# Altium schematic sheet hmi.SchDoc: HMI
size A4 portrait; Author: wq; DrawnBy: wq; Organization: Fulei Electronic; Address1: 14a Yulan Rd; Address2: Hefei; Address3: Anhui Pro.; Address4: CHN; DocumentNumber: 1; Revision: betaV1.0; SheetNumber: 1; SheetTotal: 1
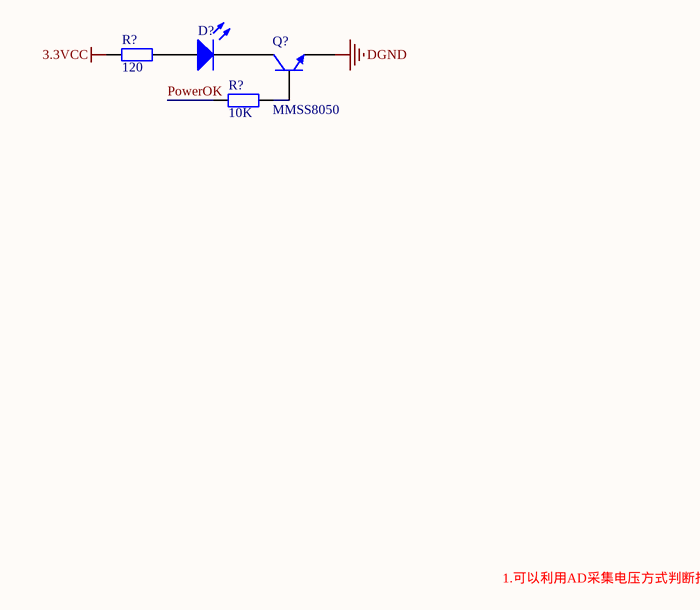
[diagram p0: hmi.SchDoc]

## Parts
(Parts that share a designator on the sheet are numbered #1, #2 ... from top to bottom, then left to right.)
D?  150080GS75000  [LEDΦ3.0]  (value not drawn)
Q?  MMSS8050  [SOT-23-BJT]
R?#1  value 120  [0805R]  (hidden comment: RC0805JR-07120RL)
R?#2  value 10K  [0805R]  (hidden comment: RC0805JR-0710KL)

## Nets
3.3VCC: R?#1.1
DGND: Q?.3(E)
PowerOK: R?#2.1
NetD?_1: D?.1(A) R?#1.2
NetD?_2: D?.2(K) Q?.1(C)
NetQ?_2: Q?.2(B) R?#2.2

## Notes on the sheet
- 1.可以利用AD采集电压方式判断按钮；节约IO
- Title
- Size:
- Date:
- A4
- Number:
- Time:
- Revision:
- Sheet
- of
- File:

## Library data of the parts
D? = LED2: Typical RED, GREEN, YELLOW, AMBER GaAs LED; Published: 8-Jun-2000; LatestRevisionDate: 17-Jul-2002; LatestRevisionNote: Re-released for DXP Platform.; PackageVersion: Feb-2002; PackageReference: 3.2X1.6X1.1; Publisher: Altium Limited; PackageDescription: SM LED; 2 Flat Leads
Q? = NPN: NPN Bipolar Transistor; Published: 8-Jun-2000; LatestRevisionDate: 17-Jul-2002; LatestRevisionNote: Re-released for DXP Platform.; PackageReference: TO-226-AA; Publisher: Altium Limited; PackageDescription: TO, Flat Index; 3 In-Line, Axial Leads; Body Dia. 4.8mm; Leads 0.55 x 0.51 mm (max); Code_JEDEC: TO-226-AA
R?#1 R?#2 = Res2: Resistor; Published: 8-Jun-2000; LatestRevisionDate: 17-Jul-2002; LatestRevisionNote: Re-released for DXP Platform.; PackageReference: AXIAL-0.4; Publisher: Altium Limited; PackageDescription: Axial Device, Thru-Hole; 2 Leads; 0.4 in Pin Spacing